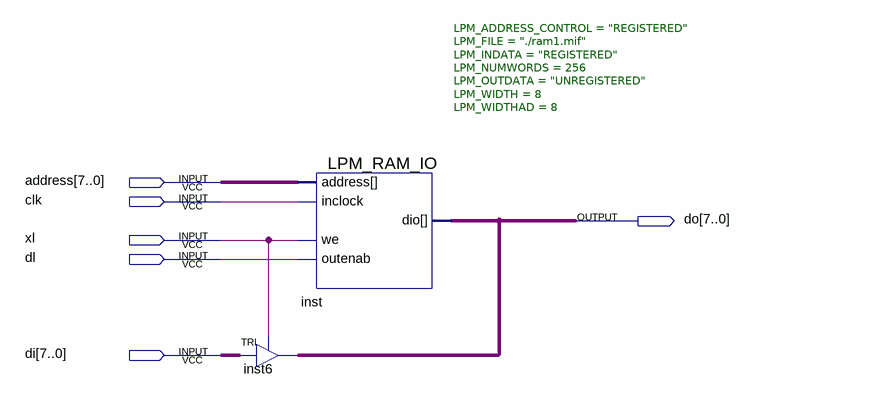
[diagram p0: schematic sheet]
// Quartus schematic ram.bdf as structural Verilog: 2 symbols, 6 pins
module ram (
  input  [7:0] address,
  input  clk,
  input  xl,
  input  dl,
  input  [7:0] di,
  output [7:0] \do 
);

  LPM_RAM_IO #(.LPM_ADDRESS_CONTROL("REGISTERED"), .LPM_FILE("./ram1.mif"), .LPM_INDATA("REGISTERED"), .LPM_NUMWORDS(256), .LPM_OUTDATA("UNREGISTERED"), .LPM_WIDTH(8), .LPM_WIDTHAD(8)) inst (
    .address(address), .inclock(clk), .we(xl), .outenab(dl), .dio(\do ));
  TRI inst6[7:0] (.IN(di), .OE(xl), .OUT(\do ));
endmodule
